# Altium schematic sheet V1.SchDoc
size A
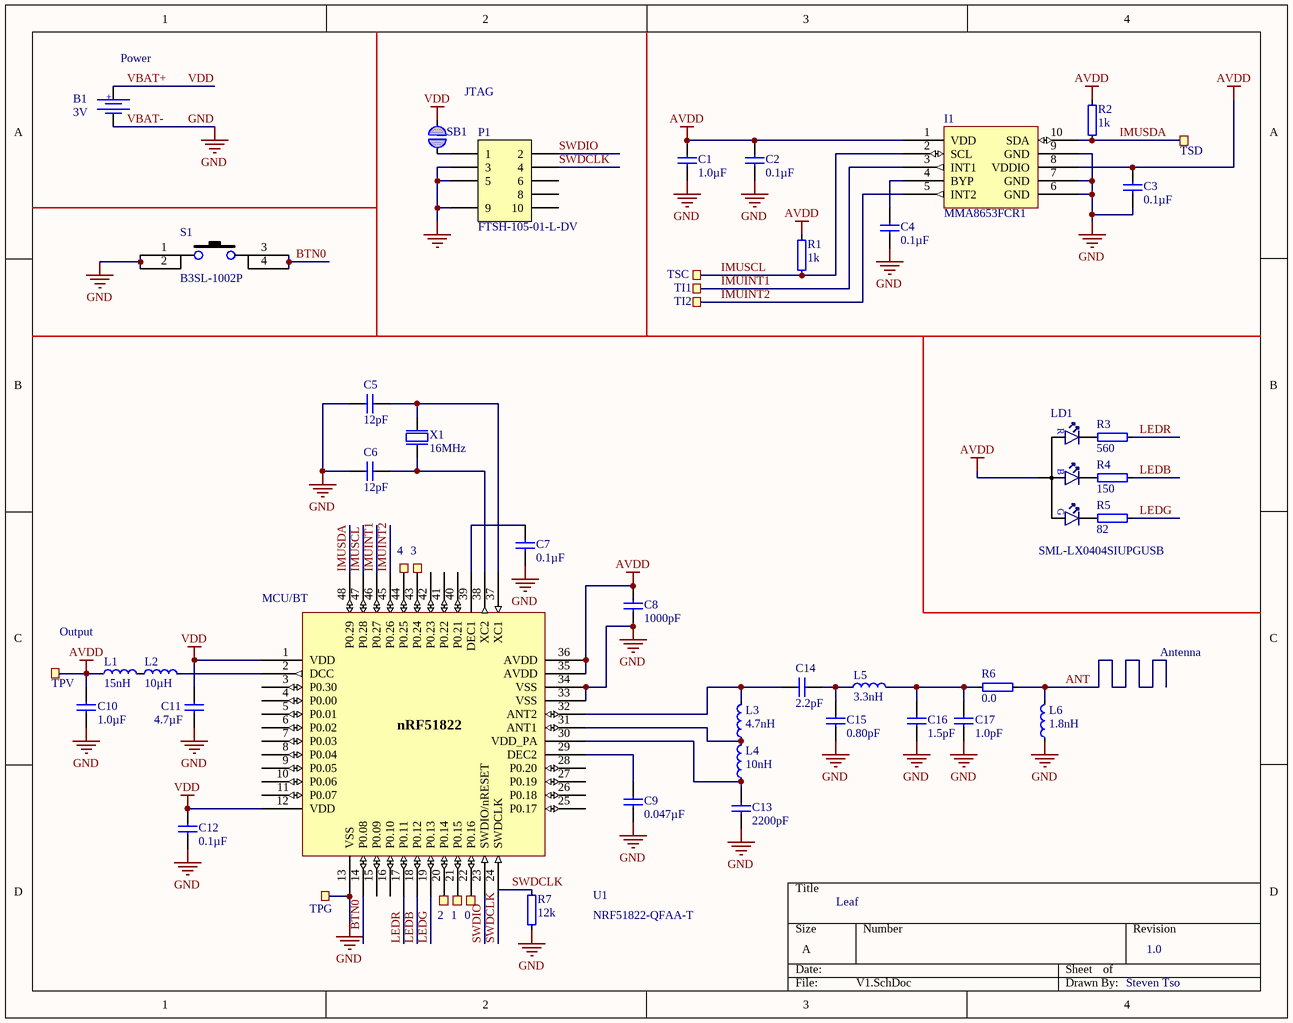
[diagram p0: V1.SchDoc]

## Parts
0  (no value)  [TP_SMD_0.5mmX0.5mm]  (no BOM)
1  (no value)  [TP_SMD_0.5mmX0.5mm]  (no BOM)
2  (no value)  [TP_SMD_0.5mmX0.5mm]  (no BOM)
3  (no value)  [TP_SMD_0.5mmX0.5mm]  (no BOM)
4  (no value)  [TP_SMD_0.5mmX0.5mm]  (no BOM)
?  LEAF_LOGO  [Leaf Logo]  (value not drawn)  (no BOM)
B1  value 3V  [BU2032SM-BT-GTR]  (hidden comment: BAT)
C1  1.0µF  [CAPC1608X06L]
C2  0.1µF  [CAPC1005X04L]
C3  0.1µF  [CAPC1005X04L]
C4  0.1µF  [CAPC1005X04L]
C5  12pF  [CAPC1005X04L]
C6  12pF  [CAPC1005X04L]
C7  0.1µF  [CAPC1005X04L]
C8  1000pF  [CAPC1005X04L]
C9  0.047µF  [CAPC1005X04L]
C10  1.0µF  [CAPC1608X06L]
C11  4.7µF  [CAPC1608X06L]
C12  0.1µF  [CAPC1005X04L]
C13  2200pF  [CAPC1005X04L]
C14  2.2pF  [CAPC1005X04L]
C15  0.80pF  [CAPC1005X04L]
C16  1.5pF  [CAPC1005X04L]
C17  1.0pF  [CAPC1005X04L]
I1  MMA8653FCR1  [DFN10P200X200X100]
L1  15nH  [INDC1608X06L]
L2  Inductance: 10µH  [INDC1608X06L]
L3  4.7nH  [INDC1005X04L]
L4  Inductance: 10nH  [INDC1005X04L]
L5  3.3nH  [INDC1005X04L]
L6  Inductance: 1.8nH  [INDC1005X04L]
LD1  (no value)  [SML-LX0404SIUPGUSB]
P1  FTSH-105-01-L-DV  [HDR_2x5-SMD-1.27mm-SWD]
R1  1k  [RESC1005X04L]
R2  1k  [RESC1005X04L]
R3  560  [RESC1005X04L]
R4  150  [RESC1005X04L]
R5  82  [RESC1005X04L]
R6  0.0  [RESC1005X04L]
R7  12k  [RESC1005X04L]
S1  Digi-Key  [B3SL-1002P]  (value not drawn)
SB1  (no value)  [Solderbridge]  (no BOM)
TI1  (no value)  [TP_SMD_0.5mmX0.5mm]  (no BOM)
TI2  (no value)  [TP_SMD_0.5mmX0.5mm]  (no BOM)
TPG  (no value)  [TP_SMD_0.5mmX0.5mm]  (no BOM)
TPV  (no value)  [TP_SMD_0.5mmX0.5mm]  (no BOM)
TSC  (no value)  [TP_SMD_0.5mmX0.5mm]  (no BOM)
TSD  (no value)  [TP_SMD_0.5mmX0.5mm]  (no BOM)
U1  NRF51822-QFAA-T  [QFN40P600X600X90-48N]
X1  16MHz  [BT-XTAL_2520]

## Nets
AVDD: C1.2 C2.2 C3.2 C8.2 C10.2 I1.1(VDD) I1.8(VDDIO) L1.1 LD1.1(A) R1.2 R2.2 TPV.1 U1.35(AVDD) U1.36(AVDD)
GND: B1.2 C1.1 C2.1 C3.1 C4.1 C5.1 C6.1 C7.1 C8.1 C9.1 C10.1 C11.1 C12.1 C13.1 C15.1 C16.1 C17.1 I1.6(GND) I1.7(GND) I1.9(GND) L6.1 P1.3 P1.5 P1.9 R7.1 S1.1 S1.2 TPG.1 U1.13(VSS) U1.33(VSS) U1.34(VSS) U1.49 X1.2(GND) X1.4(GND)  [also labelled VBAT-]
VBAT+: B1.1 C11.2 C12.2 SB1.1 U1.1(VDD) U1.12(VDD)  [also labelled VDD]
ANT: L6.2 R6.2
BTN0: S1.3 S1.4 U1.14(P0.08)
IMUINT1: I1.3(INT1) TI1.1 U1.46(P0.27)
IMUINT2: I1.5(INT2) TI2.1 U1.45(P0.26)
IMUSCL: I1.2(SCL) R1.1 TSC.1 U1.47(P0.28)
IMUSDA: I1.10(SDA) R2.1 TSD.1 U1.48(P0.29)
LEDB: R4.2 U1.18(P0.12)
LEDG: R5.2 U1.19(P0.13)
LEDR: R3.2 U1.17(P0.11)
SWDCLK: P1.4 R7.2 U1.24(SWDCLK)
SWDIO: P1.2 U1.23(SWDIO/nRESET)
Net0_1: 0.1 U1.22(P0.16)
Net1_1: 1.1 U1.21(P0.15)
Net2_1: 2.1 U1.20(P0.14)
Net3_1: 3.1 U1.43(P0.24)
Net4_1: 4.1 U1.44(P0.25)
NetC4_2: C4.2 I1.4(BYP)
NetC5_2: C5.2 U1.37(XC1) X1.3(out)
NetC6_2: C6.2 U1.38(XC2) X1.1(inp)
NetC7_2: C7.2 U1.39(DEC1)
NetC9_2: C9.2 U1.29(DEC2)
NetC13_2: C13.2 L4.1 U1.30(VDD_PA)
NetC14_1: C14.1 L3.2 U1.32(ANT2)
NetC14_2: C14.2 C15.2 L5.1
NetC16_2: C16.2 C17.2 L5.2 R6.1
NetL1_2: L1.2 L2.1
NetL2_2: L2.2 U1.2(DCC)
NetL3_1: L3.1 L4.2 U1.31(ANT1)
NetLD1_2: LD1.2(C_R) R3.1
NetLD1_3: LD1.3(C_B) R4.1
NetLD1_4: LD1.4(C_G) R5.1
NetP1_1: P1.1 SB1.2

Not connected (* = marked no-connect by the designer): P1 6 8 10; U1 3(P0.30) 4(P0.00) 5(P0.01) 6(P0.02) 7(P0.03) 8(P0.04) 9(P0.05) 10(P0.06) 11(P0.07) 15(P0.09) 16(P0.10) 25(P0.17) 26(P0.18) 27(P0.19) 28(P0.20) 40(P0.21) 41(P0.22) 42(P0.23)

## Notes on the sheet
- (near B1) Power
- JTAG
- Output
- (near U1) MCU/BT
- Antenna
- Leaf
- 1.0
- Steven Tso
- (in symbol BAT) +
- (in symbol nRF51822_QFN48_DCDC) nRF51822
- (in symbol SML-LX0404SIUPGUSB) R; B; G

## Library data of the parts
0-4 TI1 TI2 TPG TPV TSC TSD = TESTPAD: Regular Plated, 0.5mm hole
B1 = BAT: HOLDER BATTERY COIN 20MM DIA SMD; Manufacturer 1: MPD (Memory Protection Devices); Description 1: HOLDER CR2032 GOLD LEADS SMD; Battery Type, Function: Coin Cell, Holder; Style: Holder (Open); Battery Cell Size: Coin, 20.0mm; Number of Cells: 1; Battery Series: 2032; Supplier 1: Digi-Key; Supplier Part Number 1: BU2032SM-BT-GCT-ND; RoHS: RoHS Compliant; Category: Battery Products; Stock 1: 25334; Pricing 1: 1=0.6, 10=0.555, 100=0.525 (USD); Mounting Type: PCB, Surface Mount; Termination Style: SMD (SMT) Tab; Height Above Board: 0.205" (5.20mm); Operating Temperature: -40°C ~ 280°C; ComponentLink1URL: http://www.memoryprotectiondevices.com/datasheets/BU2032SM-BT-GTR-datasheet.pdf; ComponentLink1Description: http://www.memoryprotectiondevices.com/datasheets/BU2032SM-BT-GTR-datasheet.pdf; Manufacturer Part Number 1: BU2032SM-BT-GTR
C1 C10 = CAP_0603_1.0µF: CAP CER 1UF 16V 10% X7R 0603; Manufacturer 1: Taiyo Yuden; Manufacturer Part Number 1: EMK107B7105KA-T; Supplier 1: Digi-Key; Supplier Part Number 1: 587-1241-1-ND; RoHS: RoHS Compliant; Description 1: CAP CER 1UF 16V 10% X7R 0603; Category: Capacitors; Stock 1: 868936; Pricing 1: 1=0.1, 10=0.06, 50=0.0326, 100=0.0275, 250=0.02252, 500=0.01926, 1000=0.015 (USD); Packaging: Cut Tape (CT); Voltage - Rated: 16V; Tolerance: ±10%; Temperature Coefficient: X7R; Mounting Type: Surface Mount, MLCC; Operating Temperature: -55°C ~ 125°C; Applications: General Purpose; Ratings: -; Package / Case: 0603 (1608 Metric); Size / Dimension: 0.063" L x 0.031" W (1.60mm x 0.80mm); Height - Seated (Max): -; Thickness (Max): 0.035" (0.90mm); Lead Spacing: -; Features: -; Lead Style: -; ComponentLink1URL: http://www.yuden.co.jp/or/product/category/capacitor/EMK107B7105KA-T.pdf; ComponentLink1Description: http://www.yuden.co.jp/or/product/category/capacitor/EMK107B7105KA-T.pdf; Capacitance: 1.0µF
C2-C4 C7 C12 = CAP_0402_0.1µF: CAP CER 0.1UF 16V 10% X7R 0402; Manufacturer 1: Taiyo Yuden; Manufacturer Part Number 1: EMK105B7104KV-F; Supplier 1: Digi-Key; Supplier Part Number 1: 587-1451-1-ND; RoHS: RoHS Compliant; Description 1: CAP CER 0.1UF 16V 10% X7R 0402; Category: Capacitors; Stock 1: 1961539; Pricing 1: 1=0.1, 10=0.016, 50=0.0084, 100=0.0072, 250=0.00584, 500=0.005, 1000=0.0039, 5000=0.00325 (USD); Packaging: Cut Tape (CT); Voltage - Rated: 16V; Tolerance: ±10%; Temperature Coefficient: X7R; Mounting Type: Surface Mount, MLCC; Operating Temperature: -55°C ~ 125°C; Applications: General Purpose; Ratings: -; Package / Case: 0402 (1005 Metric); Size / Dimension: 0.039" L x 0.020" W (1.00mm x 0.50mm); Height - Seated (Max): -; Thickness (Max): 0.022" (0.55mm); Lead Spacing: -; Features: -; Lead Style: -; ComponentLink1URL: http://www.yuden.co.jp/or/product/category/capacitor/EMK105B7104KV-F.pdf; ComponentLink1Description: http://www.yuden.co.jp/or/product/category/capacitor/EMK105B7104KV-F.pdf; Capacitance: 0.1µF
C5 C6 = CAP_0402_12pF: CAP CER 10PF 50V 2% NP0 0402; Manufacturer 1: Johanson Technology Inc; Manufacturer Part Number 1: 500R07S120GV4T; Description 1: CAP CER 12PF 50V 2% NP0 0402; Temperature Coefficient: C0G, NP0; Supplier 1: Digi-Key; Supplier Part Number 1: 712-1256-1-ND; RoHS: RoHS Compliant; Category: Capacitors; Stock 1: 55015; Pricing 1: 1=0.32, 10=0.28, 25=0.2, 50=0.17, 100=0.14, 250=0.112, 500=0.102, 1000=0.092, 2500=0.08 (USD); Packaging: Cut Tape (CT); Voltage - Rated: 50V; Tolerance: ±2%; Mounting Type: Surface Mount, MLCC; Operating Temperature: -55°C ~ 125°C; Applications: RF, Microwave, High Frequency; Ratings: -; Package / Case: 0402 (1005 Metric); Size / Dimension: 0.040" L x 0.020" W (1.02mm x 0.51mm); Height - Seated (Max): -; Thickness (Max): 0.024" (0.61mm); Lead Spacing: -; Features: High Q, Low Loss; Lead Style: -; ComponentLink1URL: http://www.johansontechnology.com/images/stories/catalog/JTI_CAT_2012_MLCC_HighQ.pdf; ComponentLink1Description: http://www.johansontechnology.com/images/stories/catalog/JTI_CAT_2012_MLCC_HighQ.pdf; Capacitance: 12pF
C8 = CAP_0402_1000pF: CAP CER 1000PF 50V 10% X7R 0402; Manufacturer 1: Samsung Electro-Mechanics America, Inc; Manufacturer Part Number 1: CL05B102KB5NCNC; Supplier 1: Digi-Key; Supplier Part Number 1: 1276-1492-1-ND; RoHS: RoHS Compliant; Description 1: CAP CER 1000PF 50V 10% X7R 0402; Category: Capacitors; Stock 1: 41244; Pricing 1: 1=0.1, 10=0.011, 25=0.008, 50=0.006, 100=0.0051, 250=0.0042, 500=0.00358, 1000=0.00279, 2500=0.00251 (USD); Packaging: Cut Tape (CT); Voltage - Rated: 50V; Tolerance: ±10%; Temperature Coefficient: X7R; Mounting Type: Surface Mount, MLCC; Operating Temperature: -55°C ~ 125°C; Applications: General Purpose; Ratings: -; Package / Case: 0402 (1005 Metric); Size / Dimension: 0.039" L x 0.020" W (1.00mm x 0.50mm); Height - Seated (Max): -; Thickness (Max): 0.022" (0.55mm); Lead Spacing: -; Features: -; Lead Style: -; ComponentLink1URL: http://www.samsungsem.com/servlet/FileDownload?type=spec&file=CL05B102KB5NCNC.pdf; ComponentLink1Description: http://www.samsungsem.com/servlet/FileDownload?type=spec&file=CL05B102KB5NCNC.pdf; Capacitance: 1000pF
C9 = CAP_0402_0.047µF: CAP CER 0.047UF 16V 10% X7R 0402; Manufacturer 1: Samsung Electro-Mechanics America, Inc; Manufacturer Part Number 1: CL05B473KO5NNNC; Supplier 1: Digi-Key; Supplier Part Number 1: 1276-1077-1-ND; RoHS: RoHS Compliant; Description 1: CAP CER 0.047UF 16V 10% X7R 0402; Category: Capacitors; Stock 1: 43117; Pricing 1: 1=0.1, 10=0.014, 25=0.0104, 50=0.0078, 100=0.0066, 250=0.0054, 500=0.00462, 1000=0.0036, 2500=0.00324 (USD); Packaging: Cut Tape (CT); Voltage - Rated: 16V; Tolerance: ±10%; Temperature Coefficient: X7R; Mounting Type: Surface Mount, MLCC; Operating Temperature: -55°C ~ 125°C; Applications: General Purpose; Ratings: -; Package / Case: 0402 (1005 Metric); Size / Dimension: 0.039" L x 0.020" W (1.00mm x 0.50mm); Height - Seated (Max): -; Thickness (Max): 0.022" (0.55mm); Lead Spacing: -; Features: -; Lead Style: -; ComponentLink1URL: http://www.samsungsem.com/servlet/FileDownload?type=spec&file=CL05B473KO5NNNC.pdf; ComponentLink1Description: http://www.samsungsem.com/servlet/FileDownload?type=spec&file=CL05B473KO5NNNC.pdf; Capacitance: 0.047µF
C11 = CAP_0603_4.7µF: CAP CER 4.7UF 6.3V 10% X5R 0603; Manufacturer 1: Kemet; Manufacturer Part Number 1: C0603C475K9PACTU; Supplier 1: Digi-Key; Supplier Part Number 1: 399-3482-1-ND; RoHS: RoHS Compliant; Description 1: CAP CER 4.7UF 6.3V 10% X5R 0603; Category: Capacitors; Stock 1: 240677; Pricing 1: 1=0.13, 10=0.09, 50=0.0518, 100=0.0428, 250=0.036, 500=0.03016, 1000=0.02475 (USD); Packaging: Cut Tape (CT); Voltage - Rated: 6.3V; Tolerance: ±10%; Temperature Coefficient: X5R; Mounting Type: Surface Mount, MLCC; Operating Temperature: -55°C ~ 85°C; Applications: General Purpose; Ratings: -; Package / Case: 0603 (1608 Metric); Size / Dimension: 0.063" L x 0.031" W (1.60mm x 0.80mm); Height - Seated (Max): -; Thickness (Max): 0.035" (0.90mm); Lead Spacing: -; Features: -; Lead Style: -; ComponentLink1URL: http://www.kemet.com/datasheets&C0603C475K9PACTU; ComponentLink1Description: http://www.kemet.com/datasheets&C0603C475K9PACTU; Capacitance: 4.7µF
C13 = CAP_0402_2200pF: CAP CER 2200PF 50V 10% X7R 0402; Manufacturer 1: Samsung Electro-Mechanics America, Inc; Manufacturer Part Number 1: CL05B222KB5NNNC; Supplier 1: Digi-Key; Supplier Part Number 1: 1276-1054-1-ND; RoHS: RoHS Compliant; Description 1: CAP CER 2200PF 50V 10% X7R 0402; Category: Capacitors; Stock 1: 75521; Pricing 1: 1=0.1, 10=0.014, 25=0.0104, 50=0.0078, 100=0.0066, 250=0.0054, 500=0.00462, 1000=0.0036, 2500=0.00324 (USD); Packaging: Cut Tape (CT); Voltage - Rated: 50V; Tolerance: ±10%; Temperature Coefficient: X7R; Mounting Type: Surface Mount, MLCC; Operating Temperature: -55°C ~ 125°C; Applications: General Purpose; Ratings: -; Package / Case: 0402 (1005 Metric); Size / Dimension: 0.039" L x 0.020" W (1.00mm x 0.50mm); Height - Seated (Max): -; Thickness (Max): 0.022" (0.55mm); Lead Spacing: -; Features: -; Lead Style: -; ComponentLink1URL: http://www.samsungsem.com/servlet/FileDownload?type=spec&file=CL05B222KB5NNNC.pdf; ComponentLink1Description: http://www.samsungsem.com/servlet/FileDownload?type=spec&file=CL05B222KB5NNNC.pdf; Capacitance: 2200pF
C14 = CAP_0402_2.2pF: CAP CER 2.2PF 100V NP0 0402; Manufacturer 1: Kemet; Manufacturer Part Number 1: CBR04C229B1GAC; Tolerance: ±0.1pF; Temperature Coefficient: C0G, NP0; Supplier 1: Digi-Key; Supplier Part Number 1: 399-8593-1-ND; RoHS: RoHS Compliant; Description 1: CAP CER 2.2PF 100V NP0 0402; Category: Capacitors; Stock 1: 7453; Pricing 1: 1=0.21, 10=0.145, 50=0.088, 100=0.0739, 250=0.05984, 500=0.0528, 1000=0.04488, 2500=0.04136, 5000=0.03784 (USD); Packaging: Cut Tape (CT); Voltage - Rated: 100V; Mounting Type: Surface Mount, MLCC; Operating Temperature: -55°C ~ 125°C; Applications: RF, Microwave, High Frequency; Ratings: -; Package / Case: 0402 (1005 Metric); Size / Dimension: 0.039" L x 0.020" W (1.00mm x 0.50mm); Height - Seated (Max): -; Thickness (Max): 0.022" (0.55mm); Lead Spacing: -; Features: High Q, Low Loss; Lead Style: -; ComponentLink1URL: http://www.kemet.com/kemet/web/homepage/kechome.nsf/file/E8E10945B57BE93285257989006DD493/$file/KEM_C1030_CBR_SMD.pdf; ComponentLink1Description: http://www.kemet.com/kemet/web/homepage/kechome.nsf/file/E8E10945B57BE93285257989006DD493/$file/KEM_C1030_CBR_SMD.pdf; Capacitance: 2.2pF
C15 = CAP_0402_0.8pF: CAP CER 0.8PF 50V NP0 0402; Manufacturer 1: Kemet; Manufacturer Part Number 1: CBR04C808C5GAC; Tolerance: ±0.25pF; Temperature Coefficient: C0G, NP0; Supplier 1: Digi-Key; Supplier Part Number 1: 399-6160-1-ND; RoHS: RoHS Compliant; Description 1: CAP CER 0.8PF 50V NP0 0402; Category: Capacitors; Stock 1: 23376; Pricing 1: 1=0.11, 10=0.08, 50=0.0436, 100=0.0369, 250=0.03016, 500=0.0258, 1000=0.0201, 2500=0.01809, 5000=0.01675 (USD); Packaging: Cut Tape (CT); Voltage - Rated: 50V; Mounting Type: Surface Mount, MLCC; Operating Temperature: -55°C ~ 125°C; Applications: RF, Microwave, High Frequency; Ratings: -; Package / Case: 0402 (1005 Metric); Size / Dimension: 0.039" L x 0.020" W (1.00mm x 0.50mm); Height - Seated (Max): -; Thickness (Max): 0.022" (0.55mm); Lead Spacing: -; Features: High Q, Low Loss; Lead Style: -; ComponentLink1URL: http://www.kemet.com/kemet/web/homepage/kechome.nsf/file/E8E10945B57BE93285257989006DD493/$file/KEM_C1030_CBR_SMD.pdf; ComponentLink1Description: http://www.kemet.com/kemet/web/homepage/kechome.nsf/file/E8E10945B57BE93285257989006DD493/$file/KEM_C1030_CBR_SMD.pdf; Capacitance: 0.80pF
C16 = CAP_0402_1.5pF: CAP CER 1.5PF 50V NP0 0402; Manufacturer 1: Samsung Electro-Mechanics America, Inc; Manufacturer Part Number 1: CL05C1R5BB5NNNC; Tolerance: ±0.1pF; Temperature Coefficient: C0G, NP0; Supplier 1: Digi-Key; Supplier Part Number 1: 1276-1656-1-ND; RoHS: RoHS Compliant; Description 1: CAP CER 1.5PF 50V NP0 0402; Category: Capacitors; Stock 1: 28360; Pricing 1: 1=0.1, 10=0.026, 25=0.0188, 50=0.0144, 100=0.0121, 250=0.00992, 500=0.00848, 1000=0.0066, 2500=0.00594 (USD); Packaging: Cut Tape (CT); Voltage - Rated: 50V; Mounting Type: Surface Mount, MLCC; Operating Temperature: -55°C ~ 125°C; Applications: General Purpose; Ratings: -; Package / Case: 0402 (1005 Metric); Size / Dimension: 0.039" L x 0.020" W (1.00mm x 0.50mm); Height - Seated (Max): -; Thickness (Max): 0.022" (0.55mm); Lead Spacing: -; Features: -; Lead Style: -; ComponentLink1URL: http://www.samsungsem.com/servlet/FileDownload?type=spec&file=CL05C1R5BB5NNNC.pdf; ComponentLink1Description: http://www.samsungsem.com/servlet/FileDownload?type=spec&file=CL05C1R5BB5NNNC.pdf; Capacitance: 1.5pF
C17 = CAP_0402_1.0pF: CAP CER 1PF 50V NP0 0402; Manufacturer 1: Johanson Technology Inc; Manufacturer Part Number 1: 500R07S1R0BV4T; Tolerance: ±0.1pF; Temperature Coefficient: C0G, NP0; Supplier 1: Digi-Key; Supplier Part Number 1: 712-1266-1-ND; RoHS: RoHS Compliant; Category: Capacitors; Stock 1: 34245; Pricing 1: 1=0.19, 10=0.13, 25=0.0976, 50=0.0748, 100=0.0618, 250=0.052, 500=0.04356, 1000=0.03575, 2500=0.03282 (USD); Packaging: Cut Tape (CT); Voltage - Rated: 50V; Mounting Type: Surface Mount, MLCC; Operating Temperature: -55°C ~ 125°C; Applications: RF, Microwave, High Frequency; Ratings: -; Package / Case: 0402 (1005 Metric); Size / Dimension: 0.040" L x 0.020" W (1.02mm x 0.51mm); Height - Seated (Max): -; Thickness (Max): 0.024" (0.61mm); Lead Spacing: -; Features: High Q, Low Loss; Lead Style: -; ComponentLink1URL: http://www.johansontechnology.com/images/stories/catalog/JTI_CAT_2012_MLCC_HighQ.pdf; ComponentLink1Description: http://www.johansontechnology.com/images/stories/catalog/JTI_CAT_2012_MLCC_HighQ.pdf; Description 1: CAP CER 1PF 50V NP0 0402; Capacitance: 1.0pF
I1 = MMA8653FC: IC ACCELEROMETER 3AXIS 10DFN; Manufacturer 1: Freescale Semiconductor; Axis: X, Y, Z; Acceleration Range: ±2g, 4g, 8g; Sensitivity: 256 count/g, 128 count/g, 64 count/g; Voltage - Supply: 1.95 V ~ 3.6 V; Output Type: Digital - I²C; Bandwidth: 800Hz; Interface: I²C; Supplier 1: Digi-Key; Supplier Part Number 1: MMA8653FCR1CT-ND; RoHS: RoHS Compliant By Exemption; Description 1: IC ACCELEROMETER 3AXIS 10DFN; Category: Sensors, Transducers; Stock 1: 9318; Pricing 1: 1=1.09, 10=0.975, 25=0.9164, 100=0.8775, 250=0.83852, 500=0.78 (USD); Mounting Type: Surface Mount; Package / Case: 10-VFDFN; Supplier Device Package: 10-DFN (2x2); ComponentLink1URL: http://cache.freescale.com/files/sensors/doc/data_sheet/MMA8653FC.pdf; ComponentLink1Description: http://cache.freescale.com/files/sensors/doc/data_sheet/MMA8653FC.pdf; Manufacturer Part Number 1: MMA8653FCR1
L1 = IND_0603_15nH: INDUCTOR 15NH 10% 0603 SMD; Manufacturer 1: Panasonic Electronic Components; Manufacturer Part Number 1: ELJ-PE15NKFA; Type: Wirewound; Material - Core: Ceramic; Current Rating: 900mA; Shielding: Unshielded; DC Resistance (DCR): 100 mOhm Max; Q @ Freq: 9 @ 100MHz; Frequency - Self Resonant: 2.2GHz; Frequency - Test: 100MHz; Supplier 1: Digi-Key; Supplier Part Number 1: PCD1958CT-ND; RoHS: RoHS Compliant; Description 1: INDUCTOR 15NH 10% 0603 SMD; Category: Inductors, Coils, Chokes; Stock 1: 9763; Pricing 1: 1=0.34, 10=0.32, 50=0.2996, 100=0.2797, 500=0.21972, 1000=0.17978 (USD); Packaging: Cut Tape (CT); Tolerance: ±10%; Current - Saturation: -; Operating Temperature: -40°C ~ 85°C; Mounting Type: Surface Mount; Package / Case: 0603 (1608 Metric); Size / Dimension: 0.063" L x 0.031" W (1.60mm x 0.80mm); Height - Seated (Max): 0.031" (0.80mm); Supplier Device Package: 0603 (1608 Metric); ComponentLink1URL: http://industrial.panasonic.com/www-cgi/jvcr13pz.cgi?E+PZ+3+AGA0034+ELJPE15NKFA+7+WW; ComponentLink1Description: http://industrial.panasonic.com/www-cgi/jvcr13pz.cgi?E+PZ+3+AGA0034+ELJPE15NKFA+7+WW; Inductance: 15nH
L2 = IND_0603_10µH: INDUCTOR MULTILAYER 10UH 0603; Manufacturer 1: TDK Corporation; Manufacturer Part Number 1: MLZ1608E100M; Material - Core: Ferrite; Tolerance: ±20%; Current Rating: 40mA; Shielding: Shielded; DC Resistance (DCR): 900 mOhm; Frequency - Self Resonant: 30MHz; Frequency - Test: 2MHz; Supplier 1: Digi-Key; Supplier Part Number 1: 445-3166-1-ND; RoHS: RoHS Compliant; Description 1: INDUCTOR MULTILAYER 10UH 0603; Category: Inductors, Coils, Chokes; Stock 1: 26830; Pricing 1: 1=0.14, 10=0.125, 50=0.0976, 100=0.0875, 500=0.075, 1000=0.065 (USD); Packaging: Cut Tape (CT); Type: Multilayer; Current - Saturation: -; Q @ Freq: -; Operating Temperature: -55°C ~ 125°C; Mounting Type: Surface Mount; Package / Case: 0603 (1608 Metric); Size / Dimension: 0.063" L x 0.031" W (1.60mm x 0.80mm); Height - Seated (Max): 0.037" (0.95mm); Supplier Device Package: 0603 (1608 Metric); ComponentLink1URL: http://www.tdk.co.jp/tefe02/e533_mlz.pdf; ComponentLink1Description: http://www.tdk.co.jp/tefe02/e533_mlz.pdf
L3 = IND_0402_4.7nH: INDUCTOR 4.7NH 0402 SMD; Manufacturer 1: Bourns Inc.; Manufacturer Part Number 1: CW100505-4N7J; Type: Wirewound; Material - Core: Ceramic; Tolerance: ±5%; Current Rating: 640mA; Shielding: Unshielded; DC Resistance (DCR): 130 mOhm; Q @ Freq: 15 @ 250MHz; Frequency - Self Resonant: 4.775GHz; Frequency - Test: 250MHz; Supplier 1: Digi-Key; Supplier Part Number 1: CW100505-4N7JCT-ND; RoHS: RoHS Compliant; Description 1: INDUCTOR 4.7NH 0402 SMD; Category: Inductors, Coils, Chokes; Stock 1: 11681; Pricing 1: 1=0.26, 10=0.23, 25=0.204, 50=0.1786, 100=0.1658, 250=0.153, 500=0.14536, 1000=0.1173 (USD); Packaging: Cut Tape (CT); Current - Saturation: -; Operating Temperature: -55°C ~ 125°C; Mounting Type: Surface Mount; Package / Case: 0402 (1005 Metric); Size / Dimension: 0.039" L x 0.022" W (1.00mm x 0.55mm); Height - Seated (Max): 0.024" (0.60mm); Supplier Device Package: 0402 (1005 Metric); ComponentLink1URL: http://www.bourns.com/data/global/pdfs/CW100505.pdf; ComponentLink1Description: http://www.bourns.com/data/global/pdfs/CW100505.pdf; Inductance: 4.7nH
L4 = IND_0402_10nH: INDUCTOR HI FREQ 10NH 5% 0402; Manufacturer 1: Taiyo Yuden; Manufacturer Part Number 1: HK100510NJ-T; Type: Multilayer; Current Rating: 340mA; Shielding: Unshielded; DC Resistance (DCR): 310 mOhm Max; Q @ Freq: 8 @ 100MHz; Frequency - Self Resonant: 3.2GHz; Frequency - Test: 100MHz; Supplier 1: Digi-Key; Supplier Part Number 1: 587-1519-1-ND; RoHS: RoHS Compliant; Description 1: INDUCTOR HI FREQ 10NH 5% 0402; Category: Inductors, Coils, Chokes; Stock 1: 65244; Pricing 1: 1=0.02, 10=0.02, 50=0.0188, 100=0.0175, 500=0.01376, 1000=0.01125, 5000=0.009 (USD); Packaging: Cut Tape (CT); Material - Core: -; Tolerance: ±5%; Current - Saturation: -; Operating Temperature: -55°C ~ 85°C; Mounting Type: Surface Mount; Package / Case: 0402 (1005 Metric); Size / Dimension: 0.039" L x 0.020" W (1.00mm x 0.50mm); Height - Seated (Max): 0.022" (0.55mm); Supplier Device Package: 0402 (1005 Metric); ComponentLink1URL: http://www.yuden.co.jp/ut/product/category/inductor/HK100510NJ-T.pdf; ComponentLink1Description: http://www.yuden.co.jp/ut/product/category/inductor/HK100510NJ-T.pdf
L5 = IND_0402_3.3nH: INDUCTOR 3.3NH 0402 SMD; Manufacturer 1: Bourns Inc.; Manufacturer Part Number 1: CW100505-3N3J; Type: Wirewound; Material - Core: Ceramic; Tolerance: ±5%; Current Rating: 840mA; Shielding: Unshielded; DC Resistance (DCR): 66 mOhm; Q @ Freq: 20 @ 250MHz; Frequency - Self Resonant: 6GHz; Frequency - Test: 250MHz; Supplier 1: Digi-Key; Supplier Part Number 1: CW100505-3N3JCT-ND; RoHS: RoHS Compliant; Description 1: INDUCTOR 3.3NH 0402 SMD; Category: Inductors, Coils, Chokes; Stock 1: 10485; Pricing 1: 1=0.26, 10=0.23, 25=0.204, 50=0.1786, 100=0.1658, 250=0.153, 500=0.14536, 1000=0.1173 (USD); Packaging: Cut Tape (CT); Current - Saturation: -; Operating Temperature: -55°C ~ 125°C; Mounting Type: Surface Mount; Package / Case: 0402 (1005 Metric); Size / Dimension: 0.039" L x 0.022" W (1.00mm x 0.55mm); Height - Seated (Max): 0.024" (0.60mm); Supplier Device Package: 0402 (1005 Metric); ComponentLink1URL: http://www.bourns.com/data/global/pdfs/CW100505.pdf; ComponentLink1Description: http://www.bourns.com/data/global/pdfs/CW100505.pdf; Inductance: 3.3nH
L6 = IND_0402_1.8nH: CER INDUCTOR 1.8NH 0402; Manufacturer 1: Johanson Technology Inc; Manufacturer Part Number 1: L-07C1N8SV6T; Type: Multilayer; Material - Core: Ceramic; Tolerance: ±0.3nH; Current Rating: 300mA; Shielding: Unshielded; DC Resistance (DCR): 140 mOhm Max; Q @ Freq: 8 @ 100MHz; Frequency - Self Resonant: 14GHz; Frequency - Test: 100MHz; Supplier 1: Digi-Key; Supplier Part Number 1: 712-1412-1-ND; RoHS: RoHS Compliant; Description 1: CER INDUCTOR 1.8NH 0402; Category: Inductors, Coils, Chokes; Stock 1: 17869; Pricing 1: 1=0.1, 10=0.05, 25=0.0452, 50=0.0406, 100=0.0351, 250=0.03152, 500=0.02926, 1000=0.02565 (USD); Packaging: Cut Tape (CT); Current - Saturation: -; Operating Temperature: -40°C ~ 100°C; Mounting Type: Surface Mount; Package / Case: 0402 (1005 Metric); Size / Dimension: 0.039" L x 0.020" W (1.00mm x 0.50mm); Height - Seated (Max): 0.024" (0.60mm); Supplier Device Package: 0402 (1005 Metric); ComponentLink1URL: http://www.johansontechnology.com/images/stories/rf-inductors/cci/JTI_CAT_2012_Inductors_Chip.pdf; ComponentLink1Description: http://www.johansontechnology.com/images/stories/rf-inductors/cci/JTI_CAT_2012_Inductors_Chip.pdf
LD1 = SML-LX0404SIUPGUSB: RGB LED 1.00 mm x 1.00 mm SMD; Manufacturer 1: Lumex Opto/Components Inc; Description 1: LED RGB SQUARE CLEAR SMD; Color: Red, Green, Blue (RGB); Wavelength - Peak: 632nm, 518nm, 465nm; Millicandela Rating: 30mcd Red, 40mcd Green, 20mcd Blue; Voltage - Forward (Vf) Typ: 1.95V Red, 2.85V Green, 2.73V Blue; Current - Test: 2mA; Viewing Angle: 120°; Lens Type: Clear; Lens Style/Size: Square with Flat Top, 1mm; Supplier 1: Digi-Key; Supplier Part Number 1: 67-2125-1-ND; RoHS: RoHS Compliant; Category: Optoelectronics; Stock 1: 62400; Pricing 1: 1=1.2, 10=0.958, 100=0.665, 250=0.5852, 500=0.4921, 1000=0.399 (USD); Packaging: Cut Tape (CT); Wavelength - Dominant: -; Package / Case: 0404 (1010 Metric); Size / Dimension: 1.00mm L x 1.00mm W; Height: 0.25mm; Mounting Type: Surface Mount; Luminous Flux @ Current - Test: -; ComponentLink1URL: http://media.digikey.com/pdf/Data%20Sheets/Lumex%20PDFs/SML-LX0404SIUPGUSB.pdf; ComponentLink1Description: http://media.digikey.com/pdf/Data%20Sheets/Lumex%20PDFs/SML-LX0404SIUPGUSB.pdf; Manufacturer Part Number 1: SML-LX0404SIUPGUSB
P1 = CONN-2x5-SWD: FTSH-105-01-L-DV  BOARD-BOARD CONN, HEADER, 10WAY, 2ROW; Manufacturer 1: SAMTEC; Description 1: SAMTEC - FTSH-105-01-L-DV - BOARD-BOARD CONN, HEADER, 10WAY, 2ROW; Supplier 1: Newark; Supplier Part Number 1: 11P4814; RoHS: YES; Stock 1: 937; Pricing 1: 1=2.18, 10=1.91, 100=1.63, 500=1.34, 1000=1.15, 5000=1.04, 10000=0.988 (USD); ComponentLink1URL: http://www.farnell.com/datasheets/1021860.pdf; ComponentLink1Description: http://www.farnell.com/datasheets/1021860.pdf; ComponentLink2URL: http://www.samtec.com/ftppub/pdf/FTSH_SMT.PDF; ComponentLink2Description: http://www.samtec.com/ftppub/pdf/FTSH_SMT.PDF; Manufacturer Part Number 1: FTSH-105-01-L-DV
R1 R2 = RES_0402_1K: RES 1.00K OHM 1/16W 1% 0402 SMD; Manufacturer 1: Yageo; Manufacturer Part Number 1: RC0402FR-071KL; Power (Watts): 0.063W, 1/16W; Temperature Coefficient: ±100ppm/°C; Supplier 1: Digi-Key; Supplier Part Number 1: 311-1.00KLRCT-ND; RoHS: RoHS Compliant; Description 1: RES 1.00K OHM 1/16W 1% 0402 SMD; Category: Resistors; Stock 1: 5170101; Pricing 1: 1=0.1, 10=0.014, 25=0.0104, 100=0.0063, 250=0.0054, 500=0.00382, 1000=0.0027, 2500=0.00234, 5000=0.00203 (USD); Packaging: Cut Tape (CT); Tolerance: ±1%; Composition: Thick Film; Features: -; Package / Case: 0402 (1005 Metric); Supplier Device Package: 0402; Size / Dimension: 0.039" L x 0.020" W (1.00mm x 0.50mm); Height: 0.016" (0.40mm); Number of Terminations: 2; ComponentLink1URL: http://www.yageo.com/documents/recent/PYu-RC0402_51_RoHS_L_6.pdf; ComponentLink1Description: http://www.yageo.com/documents/recent/PYu-RC0402_51_RoHS_L_6.pdf; Resistance (Ohms): 1k
R3 = RES_0402_560: RES 560 OHM 1/16W 5% 0402 SMD; Manufacturer 1: Yageo; Manufacturer Part Number 1: RC0402JR-07560RL; Power (Watts): 0.063W, 1/16W; Temperature Coefficient: ±100ppm/°C; Supplier 1: Digi-Key; Supplier Part Number 1: 311-560JRCT-ND; RoHS: RoHS Compliant; Description 1: RES 560 OHM 1/16W 5% 0402 SMD; Category: Resistors; Stock 1: 68940; Pricing 1: 1=0.1, 10=0.012, 25=0.0092, 100=0.0055, 250=0.00476, 500=0.00336, 1000=0.00237, 2500=0.00206, 5000=0.00178 (USD); Packaging: Cut Tape (CT); Tolerance: ±5%; Composition: Thick Film; Features: -; Package / Case: 0402 (1005 Metric); Supplier Device Package: 0402; Size / Dimension: 0.039" L x 0.020" W (1.00mm x 0.50mm); Height: 0.016" (0.40mm); Number of Terminations: 2; ComponentLink1URL: http://www.yageo.com/documents/recent/PYu-RC0402_51_RoHS_L_6.pdf; ComponentLink1Description: http://www.yageo.com/documents/recent/PYu-RC0402_51_RoHS_L_6.pdf; Resistance (Ohms): 560
R4 = RES_0402_150: RES 150 OHM 1/16W 5% 0402 SMD; Manufacturer 1: Yageo; Manufacturer Part Number 1: RC0402JR-07150RL; Power (Watts): 0.063W, 1/16W; Temperature Coefficient: ±100ppm/°C; Supplier 1: Digi-Key; Supplier Part Number 1: 311-150JRCT-ND; RoHS: RoHS Compliant; Description 1: RES 150 OHM 1/16W 5% 0402 SMD; Category: Resistors; Stock 1: 285028; Pricing 1: 1=0.1, 10=0.012, 25=0.0092, 100=0.0055, 250=0.00476, 500=0.00336, 1000=0.00237, 2500=0.00206, 5000=0.00178 (USD); Packaging: Cut Tape (CT); Tolerance: ±5%; Composition: Thick Film; Features: -; Package / Case: 0402 (1005 Metric); Supplier Device Package: 0402; Size / Dimension: 0.039" L x 0.020" W (1.00mm x 0.50mm); Height: 0.016" (0.40mm); Number of Terminations: 2; ComponentLink1URL: http://www.yageo.com/documents/recent/PYu-RC0402_51_RoHS_L_6.pdf; ComponentLink1Description: http://www.yageo.com/documents/recent/PYu-RC0402_51_RoHS_L_6.pdf; Resistance (Ohms): 150
R5 = RES_0402_82: RES 82 OHM 1/16W 1% 0402 SMD; Manufacturer 1: Yageo; Manufacturer Part Number 1: RC0402FR-0782RL; Power (Watts): 0.063W, 1/16W; Temperature Coefficient: ±100ppm/°C; Supplier 1: Digi-Key; Supplier Part Number 1: 311-82LRCT-ND; RoHS: RoHS Compliant; Description 1: RES 82 OHM 1/16W 1% 0402 SMD; Category: Resistors; Stock 1: 157223; Pricing 1: 1=0.1, 10=0.014, 25=0.0104, 100=0.0063, 250=0.0054, 500=0.00382, 1000=0.0027, 2500=0.00234, 5000=0.00203 (USD); Packaging: Cut Tape (CT); Tolerance: ±1%; Composition: Thick Film; Features: -; Package / Case: 0402 (1005 Metric); Supplier Device Package: 0402; Size / Dimension: 0.039" L x 0.020" W (1.00mm x 0.50mm); Height: 0.016" (0.40mm); Number of Terminations: 2; ComponentLink1URL: http://www.yageo.com/documents/recent/PYu-RC0402_51_RoHS_L_6.pdf; ComponentLink1Description: http://www.yageo.com/documents/recent/PYu-RC0402_51_RoHS_L_6.pdf; Resistance (Ohms): 82
R6 = RES_0402_0: RES 0.0 OHM 1/16W JUMP 0402 SMD; Manufacturer 1: Yageo; Manufacturer Part Number 1: RC0402JR-070RL; Tolerance: Jumper; Power (Watts): 0.063W, 1/16W; Supplier 1: Digi-Key; Supplier Part Number 1: 311-0.0JRCT-ND; RoHS: RoHS Compliant; Description 1: RES 0.0 OHM 1/16W JUMP 0402 SMD; Category: Resistors; Stock 1: 8260595; Pricing 1: 1=0.1, 10=0.012, 25=0.0092, 100=0.0055, 250=0.00476, 500=0.00336, 1000=0.00237, 2500=0.00206, 5000=0.00178 (USD); Packaging: Cut Tape (CT); Composition: Thick Film; Features: -; Temperature Coefficient: -; Package / Case: 0402 (1005 Metric); Supplier Device Package: 0402; Size / Dimension: 0.039" L x 0.020" W (1.00mm x 0.50mm); Height: 0.016" (0.40mm); Number of Terminations: 2; ComponentLink1URL: http://www.yageo.com/documents/recent/PYu-RC0402_51_RoHS_L_6.pdf; ComponentLink1Description: http://www.yageo.com/documents/recent/PYu-RC0402_51_RoHS_L_6.pdf; Resistance (Ohms): 0.0
R7 = RES_0402_12K: RES 12.0K OHM 1/16W 1% 0402 SMD; Manufacturer 1: Yageo; Manufacturer Part Number 1: RC0402FR-0712KL; Power (Watts): 0.063W, 1/16W; Temperature Coefficient: ±100ppm/°C; Supplier 1: Digi-Key; Supplier Part Number 1: 311-12.0KLRCT-ND; RoHS: RoHS Compliant; Description 1: RES 12.0K OHM 1/16W 1% 0402 SMD; Category: Resistors; Stock 1: 314224; Pricing 1: 1=0.1, 10=0.014, 25=0.0104, 100=0.0063, 250=0.0054, 500=0.00382, 1000=0.0027, 2500=0.00234, 5000=0.00203 (USD); Packaging: Cut Tape (CT); Tolerance: ±1%; Composition: Thick Film; Features: -; Package / Case: 0402 (1005 Metric); Supplier Device Package: 0402; Size / Dimension: 0.039" L x 0.020" W (1.00mm x 0.50mm); Height: 0.016" (0.40mm); Number of Terminations: 2; ComponentLink1URL: http://www.yageo.com/documents/recent/PYu-RC0402_51_RoHS_L_6.pdf; ComponentLink1Description: http://www.yageo.com/documents/recent/PYu-RC0402_51_RoHS_L_6.pdf; Resistance (Ohms): 12k
S1 = B3SL-1002P: SWITCH TACTILE SPST-NO 0.05A 12V; Manufacturer 1: Omron Electronics Inc-EMC Div; Switch Function: Off-Mom; Contact Rating @ Voltage: 0.05A @ 12VDC; Actuator Type: Standard; Actuator Height off PCB, from Pins: 3.40mm; Actuator Orientation: Top Actuated; Outline: 6.00mm x 6.00mm; Illumination: Non-Illuminated; Operating Force: 200gf; Ingress Protection: IP67 - Dust Tight, Waterproof; Actuator Material: Rubber; Switch Travel: 0.30mm; Mechanical Life: 100,000 Cycles; Supplier 1: Digi-Key; Supplier Part Number 1: SW1064CT-ND; RoHS: RoHS Compliant; Description 1: SWITCH TACTILE SPST-NO 0.05A 12V; Category: Switches; Stock 1: 1994; Pricing 1: 1=0.83, 10=0.804, 25=0.7588, 50=0.6676, 100=0.607, 250=0.57664, 500=0.56146, 1000=0.44006 (USD); Packaging: Cut Tape (CT); Circuit: SPST-NO; Mounting Type: Surface Mount; Termination Style: SMD (SMT) Tab; Illumination Voltage (Nominal): -; Illumination Type, Color: -; Features: Sealed - Fully; Operating Temperature: -25°C ~ 90°C; ComponentLink1URL: http://components.omron.com/components/web/pdflib.nsf/0/08698493193ABB20862574E8006A227D/$file/B3SL_1110.pdf; ComponentLink1Description: http://components.omron.com/components/web/pdflib.nsf/0/08698493193ABB20862574E8006A227D/$file/B3SL_1110.pdf; Manufacturer Part Number 1: B3SL-1002P
SB1 = SOLDERBRIDGE
U1 = nRF51822_QFN48_DCDC: MULTIPROTOCOL BLUETOOTH 4.0 LOW ENERGY/2.4 GHZ RF SOC; Manufacturer 1: Nordic Semiconductors; Supplier 1: Arrow; Supplier Part Number 1: NRF51822-QFAA-T; RoHS: eurohs: Compliant / cnrohs: Compliant; Description 1: MULTIPROTOCOL BLUETOOTH 4.0 LOW ENERGY/2.4 GHZ RF SOC; Stock 1: 4755; Pricing 1: 1=2.91 (); Package Quantity: 1; ComponentLink1URL: http://components.arrow.com/part/detail/56492542S527112N7340?region=na; ComponentLink1Description: http://components.arrow.com/part/detail/56492542S527112N7340?region=na; Manufacturer Part Number 1: NRF51822-QFAA-T
X1 = XTAL_TSX-2520: XTAL SMD 2520, 16MHz, 8pF, ±15ppm; Manufacturer 1: NDK; Manufacturer Part Number 1: NX2520SA-16MHZ-STD-CSW-4; Description 1: CRYSTAL 16MHZ 8PF SMD; ESR (Equivalent Series Resistance): 80 Ohm; Operating Mode: Fundamental; Supplier 1: Digi-Key; Supplier Part Number 1: 644-1168-1-ND; RoHS: RoHS Compliant; Category: Crystals and Oscillators; Stock 1: 3956; Pricing 1: 1=1.62, 10=1.404, 50=1.2312, 100=0.972, 500=0.8208, 1000=0.648 (USD); Packaging: Cut Tape (CT); Type: MHz Crystal; Frequency Stability: ±15ppm; Frequency Tolerance: ±15ppm; Load Capacitance: 8pF; Operating Temperature: -10°C ~ 75°C; Ratings: -; Mounting Type: Surface Mount; Package / Case: 4-SMD; Size / Dimension: 0.098" L x 0.079" W (2.50mm x 2.00mm); Height: 0.022" (0.55mm); ComponentLink1URL: http://www.ndk.com/images/products/catalog/c_NX2520SA-STD-CSW-4_e.pdf; ComponentLink1Description: http://www.ndk.com/images/products/catalog/c_NX2520SA-STD-CSW-4_e.pdf; Frequency: 16MHz